# Altium schematic sheet OpAmp_Inverting.SchDoc
size 76 x 30 mm
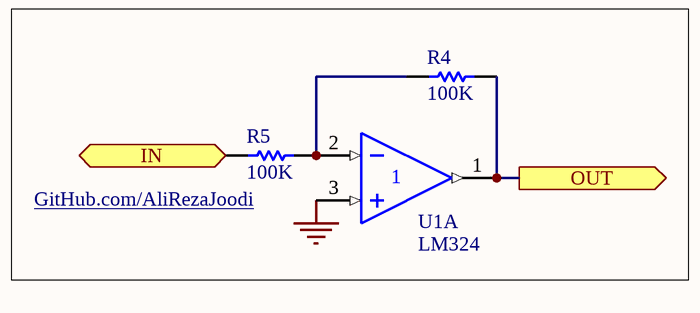
[diagram p0: OpAmp_Inverting.SchDoc]

## Parts
R4  100K  [AXIAL-0.4]
R5  100K  [AXIAL-0.4]
U1  LM324  [646-06]  (part A of 5)

## Ports
IN (in), OUT (out)

## Nets
GND: U1.3(IN+)
IN: R5.2 ; port IN
OUT: R4.2 U1.1(OUT) ; port OUT
NetR4_1: R4.1 R5.1 U1.2(IN-)

## Notes on the sheet
- (near R5) GitHub.com/AliRezaJoodi

## Library data of the parts
R4 R5 = Res1: Resistor; Published: 8-Jun-2000; LatestRevisionDate: 17-Jul-2002; LatestRevisionNote: Re-released for DXP Platform.; PackageReference: AXIAL-0.3; Publisher: Altium Limited
U1 = LM324: Quad Low-Power Operational Amplifier; Published: 17-Jul-2002; LatestRevisionDate: 06-Jun-2005; LatestRevisionNote: Stylized 3D Model Added.; DatasheetVersion: 1988; PackageVersion: 1997; PackageReference: 646-06; Publisher: Altium Limited; PackageDescription: DIP; 14 Leads; Row Spacing 7.62 mm; Pitch 2.54 mm; ComponentLink1Description: Manufacturer Link; ComponentLink1URL: http://www.onsemi.com/site/products/parametrics/0,4446,251,00.html; ComponentLink2Description: Datasheet; ComponentLink2URL: http://www.onsemi.com/pub/Collateral/LM324-D.PDF